# EAGLE design ArduinoNano LearningBot 4-21-18 (EAGLE 8.4.1)
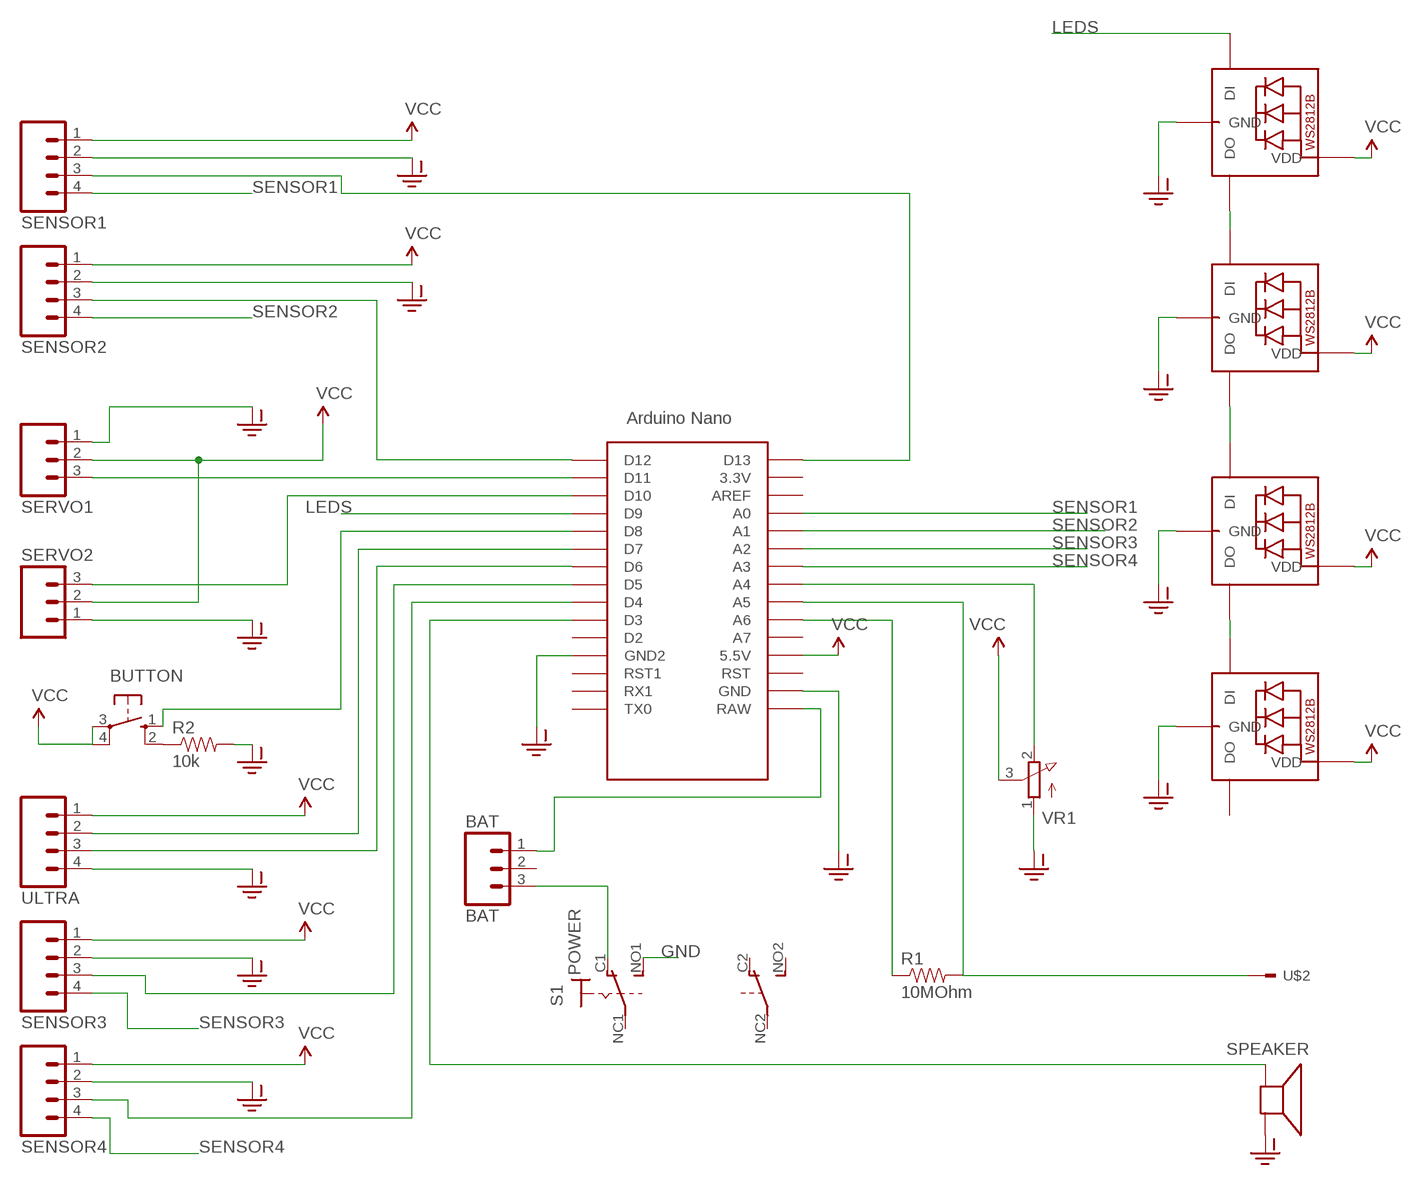
[diagram p0: schematic, sheet 1]

## Parts
BAT  BAT  M03POLAR  [MOLEX-1X3]
BUTTON  10-XX  [B3F-10XX]
LED1  WS2812B5050  [WS2812B]
LED2  WS2812B5050  [WS2812B]
LED3  WS2812B5050  [WS2812B]
LED4  WS2812B5050  [WS2812B]
R1  10MOhm  RESISTORPTH-1/4W  [AXIAL-0.4]
R2  10k  RESISTORPTH-1/4W  [AXIAL-0.4]
S1  POWER  SWITCH_320-938  [PS22F03]
SENSOR1  M04LOCK  [1X04_LOCK]
SENSOR2  M04LOCK  [1X04_LOCK]
SENSOR3  M04LOCK  [1X04_LOCK]
SENSOR4  M04LOCK  [1X04_LOCK]
SERVO1  M03LOCK  [1X03_LOCK]
SERVO2  M03LOCK  [1X03_LOCK]
SPEAKER  SPEAKER/AL60P  [AL60P]
U$1  ARDUINO-CLONE_NANO  [ARDUINO-CLONE_NANO]
U$2  TOUCHSENSOR  [TOUCH1]
ULTRA  M04LOCK  [1X04_LOCK]
VR1  3RP/1610N-VERTICAL  [3RP/1610N-VERTICAL]

## Nets
BUTTON: BUTTON.1(S) U$1.D8
CAP_TOUCH_RECEIVE_PIN: R1.P$1 U$1.A6
ECHO_PIN: U$1.D6 ULTRA.3
GND: LED1.3-GND(GND) LED2.3-GND(GND) LED3.3-GND(GND) LED4.3-GND(GND) R2.P$2 S1.NO1(1:S) SENSOR1.2 SENSOR2.2 SENSOR3.2 SENSOR4.2 SERVO1.1 SERVO2.1 SPEAKER.1(+) U$1.GND U$1.GND1(GND2) ULTRA.4 VR1.1(A) ; supply symbol labelled GND-ISO
IR_SENSOR1_DO: SENSOR2.3 U$1.D12
IR_SENSOR2_DO: SENSOR3.3 U$1.D5
LDR1_DO: SENSOR1.3 U$1.D13
LDR2_DO: SENSOR4.3 U$1.D4
LEDS: LED1.4-DIN(DI) U$1.D9
N$1: LED2.2-DOUT(DO)
N$2: LED3.4-DIN(DI)
N$3: BUTTON.2(S1) R2.P$1
N$4: LED3.2-DOUT(DO) LED4.4-DIN(DI)
N$5: LED1.2-DOUT(DO) LED2.4-DIN(DI)
N$6: SERVO1.3 U$1.D11
N$9: BAT.3 S1.C1(1:O)
POTPIN: U$1.A4 VR1.2(E)
RAWIN: BAT.1 U$1.RAW
SENSOR1: SENSOR1.4 U$1.A0
SENSOR2: SENSOR2.4 U$1.A1
SENSOR3: SENSOR3.4 U$1.A2
SENSOR4: SENSOR4.4 U$1.A3
SERVO2_PIN: SERVO2.3 U$1.D10
SPEAKERPIN: SPEAKER.2(-) U$1.D3
TOUCH: R1.P$2 U$1.A5 U$2.P$1
TRIG_PIN: U$1.D7 ULTRA.2
VCC: BUTTON.3(P) BUTTON.4(P1) LED1.1-VDD(VDD) LED2.1-VDD(VDD) LED3.1-VDD(VDD) LED4.1-VDD(VDD) SENSOR1.1 SENSOR2.1 SENSOR3.1 SENSOR4.1 SERVO1.2 SERVO2.2 U$1.5V(5.5V) ULTRA.1 VR1.3(S)
Unconnected: BAT.2 LED4.2-DOUT(DO) S1.C2(B:O) S1.NC1(1:P) S1.NC2(B:P) S1.NO2(B:S) U$1.3.3V U$1.A7 U$1.AREF U$1.D2 U$1.RST U$1.RST1 U$1.RX1 U$1.TX0

## Library data of the parts
BAT SERVO1 SERVO2 = SparkFun-Connectors:M03: Header 3 Standard 3-pin 0.1" header. Use with straight break away headers (SKU : PRT-00116), right angle break away headers (PRT-00553), swiss pins (PRT-00743), machine pins (PRT-00117), and female headers (PRT-00115). Molex polarized connector foot print use with SKU : PRT-08232 with associated crimp pins and housings.
BUTTON = switch-omron:10-XX: OMRON SWITCH; MPN: B3F-1000; OC_FARNELL: 176432; OC_NEWARK: 36M3542
LED1-LED4 = adafruit:WS2812B
R1 R2 = SparkFun-Passives:RESISTOR: Resistor Basic schematic elements and footprints for 0603, 1206, and PTH resistors.
S1 = ArduinoNano LearningBot 4-21-18:SWITCH_320-938: TOGGLE SWITCH distributor RS Components
SENSOR1-SENSOR4 ULTRA = SparkFun-Connectors:M04: Header 4 Standard 4-pin 0.1" header. Use with straight break away headers (SKU : PRT-00116), right angle break away headers (PRT-00553), swiss pins (PRT-00743), machine pins (PRT-00117), and female headers (PRT-00115). Molex polarized connector foot print use with SKU : PRT-08231 with associated crimp pins and housings. 1MM SMD Version SKU: PRT-10208; PROD_ID: CONN-09696
SPEAKER = adafruit:SPEAKER: SPEAKER Source: Buerklin Added PS12 (for part # PS1240 piezo) http://www.ladyada.net/library/pcb/eaglelibrary.html
U$1 = ArduinoNano LearningBot 3-15-18:ARDUINO-CLONE_NANO: Arduino Nano
U$2 = CapTouch:TOUCHSENSOR
VR1 = pot:3RP/1610N-VERTICAL: 16mm Potentiometer one level Source: http://www.alphapotentiometers.net/html/16mm_pot_2.html

## Board
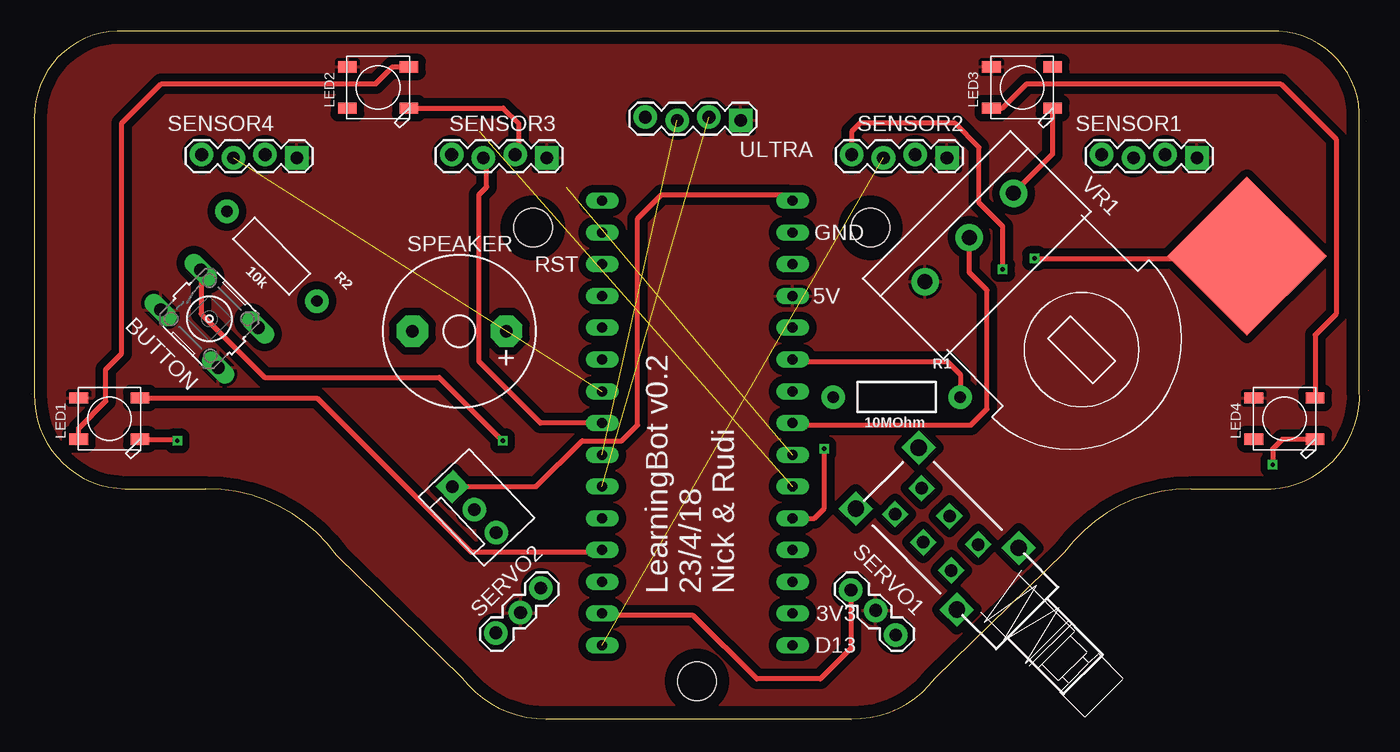
[diagram p1: board, top side]
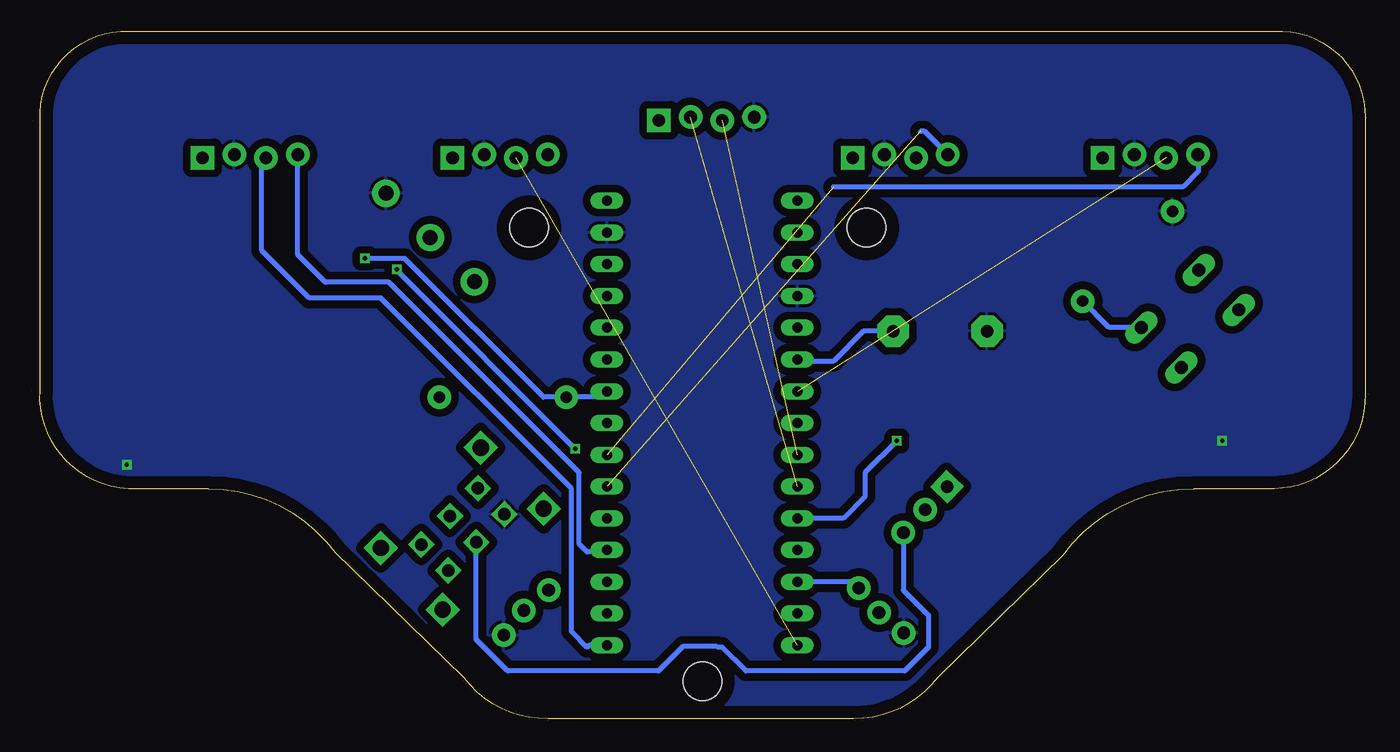
[diagram p2: board, bottom side, seen from below]

Size 106.95 x 55.14 mm. Coordinates in mm from the lower left corner, seen from the top.
Outline: 24.44,13.19 34.43,3.44
Outline: 34.43,3.44 arc-180 34.43,3.44 arc-180 34.43,3.44
Outline: 24.44,13.19 arc180 24.44,13.19 arc180 24.44,13.19
Outline: 34.43,3.44 arc54 41.19,0.14 65.6,0.14 arc54 72.31,3.4
Outline: 41.19,0 arc180 41.19,0
Outline: 65.6,0 arc180 65.6,0
Outline: 41.19,0 arc180 41.19,0
Outline: 65.6,0 arc180 65.6,0
Outline: 72.31,3.4 arc-180 72.32,3.39 arc-180 72.31,3.4
Outline: 72.31,3.4 82.63,13.42
Outline: 82.63,13.42 arc180 82.63,13.42
Outline: 92.74,18.53 arc54 82.63,13.42
Outline: 92.74,18.53 arc-180 92.74,18.53 arc-180 92.74,18.53
Outline: 82.63,13.42 arc180 82.63,13.42
Outline: 92.74,18.53 99.17,18.53
Outline: 99.17,18.53 arc-180 99.17,18.53 arc-180 99.17,18.53
Outline: 99.17,18.53 arc90 106.25,26.37 106.25,47.95 arc90 99.8,55.14 6.87,55.14 arc90 0.25,48.23 0.25,26.1 arc90 7.51,18.53
Outline: 0.18,48.23 arc180 0.18,48.23
Outline: 0.18,48.23 arc180 0.18,48.23
Outline: 7.51,18.53 arc-180 7.51,18.53 arc-180 7.51,18.53
Outline: 7.51,18.53 13.96,18.53
Outline: 13.96,18.53 arc-180 13.96,18.53 arc-180 13.96,18.53
Outline: 24.44,13.19 arc54 13.96,18.53
Outline: 106.95,26.37 arc180 106.94,26.37 arc180 106.95,26.37
Outline: 106.77,47.95 arc180 106.77,47.95 arc180 106.77,47.95
Outline: 0,26.1 arc180 0,26.1 arc180 0,26.1
Copper layers (1*16): Top 0.035mm / dielectric 1.5mm / Bottom 0.035mm
Design rules "default": minimum track width 6mil, minimum drill 0.35mm, track to track 6mil, track to pad 6mil, pad to pad 6mil, via to via 6mil, smd to smd 6mil, copper to edge 40mil, drill to drill 6mil, minimum pad ring 10mil, minimum via ring 8mil, stop-mask expansion 4mil, vias tented up to drill 0mil, thermal gap 10mil
Holes 3.1 mm at 53.25,3.14 40.13,39.41 67.13,39.41

### Footprints (pad centres in the part's own frame; a part is rotated, then mirrored left to right if it is on the bottom)
MOLEX-1X3 = drill 1.016 pad 1.88 square: 1 0,0 | drill 1.016 pad 1.88: 2 2.54,0; 3 5.08,0
B3F-10XX = drill 1.016 long: 1 -3.251,2.261; 2 3.251,2.261; 3 -3.251,-2.261; 4 3.251,-2.261
WS2812B = smd 1.5 x 0.9: 1-VDD 2.45,-1.65; 2-DOUT 2.45,1.65; 3-GND -2.45,1.65; 4-DIN -2.45,-1.65
AXIAL-0.4 = drill 0.9 pad 1.88: P$1 -5.08,0; P$2 5.08,0
PS22F03 = drill 1.3 square: 0 -3.175,5.715; 1 3.835,5.613; 2 3.81,-5.715; 3 -3.175,-5.715 | drill 1 square: C1 -1.27,0; C2 1.702,0; NC1 -1.27,-3.175; NC2 1.727,-3.226; NO1 -1.27,3.175; NO2 1.702,3.15
1X04_LOCK = drill 1.016 pad 1.88 square: 1 0,0.127 | drill 1.016 pad 1.88: 2 2.54,-0.127; 3 5.08,0.127; 4 7.62,-0.127
1X03_LOCK = drill 1.016 pad 1.88: 1 0,0.127; 2 2.54,-0.127; 3 5.08,0.127
AL60P = drill 1.016 pad 2.54 octagon: 1 -3.759,0; 2 3.759,0
ARDUINO-CLONE_NANO = drill 0.8 long: 3.3V -10.16,24.13; 5V -10.16,-1.27; A0 -10.16,19.05; A1 -10.16,16.51; A2 -10.16,13.97; A3 -10.16,11.43; A4 -10.16,8.89; A5 -10.16,6.35; A6 -10.16,3.81; A7 -10.16,1.27; AREF -10.16,21.59; D2 5.08,1.27; D3 5.08,3.81; D4 5.08,6.35; D5 5.08,8.89; D6 5.08,11.43; D7 5.08,13.97; D8 5.08,16.51; D9 5.08,19.05; D10 5.08,21.59; D11 5.08,24.13; D12 5.08,26.67; D13 -10.16,26.67; GND -10.16,-6.35; GND1 5.08,-1.27; RAW -10.16,-8.89; RST -10.16,-3.81; RST1 5.08,-3.81; RX1 5.08,-6.35; TX0 5.08,-8.89
TOUCH1 = smd 9 x 9: P$1 0,0
3RP/1610N-VERTICAL = drill 1.2 pad 2.184: 1 -5,0; 2 0,0; 3 5,0

### Placement (x,y rotation side)
BAT  [MOLEX-1X3]  33.69,18.7 313.5 top
BUTTON  14.25,32.14 315 top
LED1  6.25,24.14 180 top
LED2  27.75,50.64 180 top
LED3  79.25,50.64 180 top
LED4  100.25,24.14 180 top
R1  69.23,25.86 180 top
R2  19.25,37.14 135 top
S1  [PS22F03]  72.25,15.14 45 top
SENSOR1  93.25,45.14 180 top
SENSOR2  73.25,45.14 180 top
SENSOR3  41.25,45.14 180 top
SENSOR4  21.25,45.14 180 top
SERVO1  69.25,6.91 135 top
SERVO2  37.25,6.91 45 top
SPEAKER  34.25,31.14 0 top
U$1  50.75,32.68 180 top
U$2  97.25,37.14 45 top
ULTRA  56.75,48.14 180 top
VR1  75.03,38.63 225 top

### Tracks (layer width: path | path; a pad name or v marks a point on that pad's centre or on a via)
BUTTON  (via drill 0.35 pad 0.6)
  Top 0.406: BUTTON.1 13.58,36 13.58,32.52 18.66,27.44 32.63,27.44 v37.71,22.36
  Bottom 0.406: v37.71,22.36 40.25,19.82 40.25,17.92 42,16.17 U$1.D8
CAP_TOUCH_RECEIVE_PIN
  Top 0.406: U$1.A6 61.06,28.71 73.27,28.71 74.31,27.68 R1.P$1
ECHO_PIN  (1 unrouted)
GND  (via drill 0.35 pad 0.6)
  Top 0.406: LED2.3-GND 37.76,48.99 38.98,47.76 38.98,45.54 SENSOR3.2 | LED3.3-GND 81.7,45.29 VR1.1 | LED1.3-GND 11.55,22.49 v11.68,22.36 | LED4.3-GND 100.07,22.49 99.31,21.73 v99.31,20.46
  pour Bottom (isolate 0.61): -1.21,63.53 115.63,63.53 115.63,-6.32 -1.21,-6.32
IR_SENSOR1_DO  (1 unrouted)
IR_SENSOR2_DO
  Top 0.406: U$1.D5 40.73,23.79 35.81,28.71 35.81,42.05 36.44,42.68 36.44,44.73 SENSOR3.3
LDR1_DO
  Bottom 0.406: U$1.D13 62.32,6.01 62.48,5.85 63.75,7.12 63.75,18.55 78.99,33.79 84.7,33.79 88.51,37.6 88.51,44.66 SENSOR1.3
LDR2_DO  (1 unrouted)
LEDS
  Top 0.406: LED1.4-DIN 22.86,25.79 35.17,13.47 45.51,13.47 U$1.D9
N$3
  Bottom 0.406: BUTTON.2 20.73,31.44 R2.P$1
N$4
  Top 0.406: LED3.2-DOUT 77.67,48.99 79.62,50.94 99.94,50.94 104.39,46.49 104.39,32.52 102.7,30.83 LED4.4-DIN
N$5
  Top 0.406: LED1.2-DOUT 3.8,23.37 5.96,25.54 5.96,28.08 7.23,29.35 7.23,47.76 10.41,50.94 27.55,50.94 28.9,52.29 LED2.4-DIN
N$6
  Top 0.406: SERVO1.3 65.56,5.76 63.11,3.31 58.03,3.31 52.95,8.39 45.82,8.39 U$1.D11
N$9
  Bottom 0.406: BAT.3 37.19,10.41 35.17,8.39 35.17,5.85 37.08,3.95 49.78,3.95 51.68,5.85 52.04,5.85 52.1,5.9 54.8,5.9 56.76,3.95 68.83,3.95 71.37,6.49 71.37,14.22 S1.C1
POTPIN
  Top 0.406: U$1.A4 61.06,23.63 75.18,23.63 76.45,24.9 76.45,34.43 75.03,35.84 VR1.2
RAWIN
  Top 0.406: BAT.1 40.4,18.7 44.06,22.36 47.24,22.36 48.51,23.63 48.51,40.14 50.41,42.05 60.43,42.05 U$1.RAW
SENSOR1
  Bottom 0.406: SENSOR1.4 85.63,37.26 83.43,35.06 78.35,35.06 63.11,19.82 63.11,14.11 62.48,13.47 61.06,13.47 U$1.A0
SENSOR2  (via drill 0.35 pad 0.6)
  Top 0.406: U$1.A1 62.63,16.17 63.43,16.96 v63.43,21.73 | v77.72,36.08 77.72,39.51 75.81,41.41 75.81,45.86 73.91,47.76 66.29,47.76 65.63,47.1 SENSOR2.4
  Bottom 0.406: v77.72,36.08 77.72,36.01 v63.43,21.73
SENSOR3  (1 unrouted)
  Bottom 0.406: SENSOR3.4 35.49,47.13 35.81,47.13
SENSOR4  (1 unrouted)
  Bottom 0.406: SENSOR4.4 13.58,45.22 13.58,43.95 14.85,42.68 20.57,42.68 42.79,42.68
SERVO2_PIN
  Bottom 0.406: SERVO2.3 41.25,11.09 U$1.D10
SPEAKERPIN
  Bottom 0.406: SPEAKER.2 40.37,31.14 42.79,28.71 45.51,28.71 U$1.D3
TOUCH  (via drill 0.35 pad 0.6)
  Top 0.406: U$2.P$1 97.08,36.97 v80.26,36.97
  Bottom 0.406: U$1.A5 61.38,25.86 R1.P$2 65.97,25.86 77.08,36.97 v80.26,36.97
TRIG_PIN  (1 unrouted)
VCC
  pour Top (isolate 0.61): -4.39,61.62 112.45,61.62 112.45,-8.23 -4.39,-8.23

### Text on the board
tPlace: + | LearningBot v0.2 / 23/4/18 / Nick & Rudi